# Altium schematic sheet Shifters.SchDoc
size A4
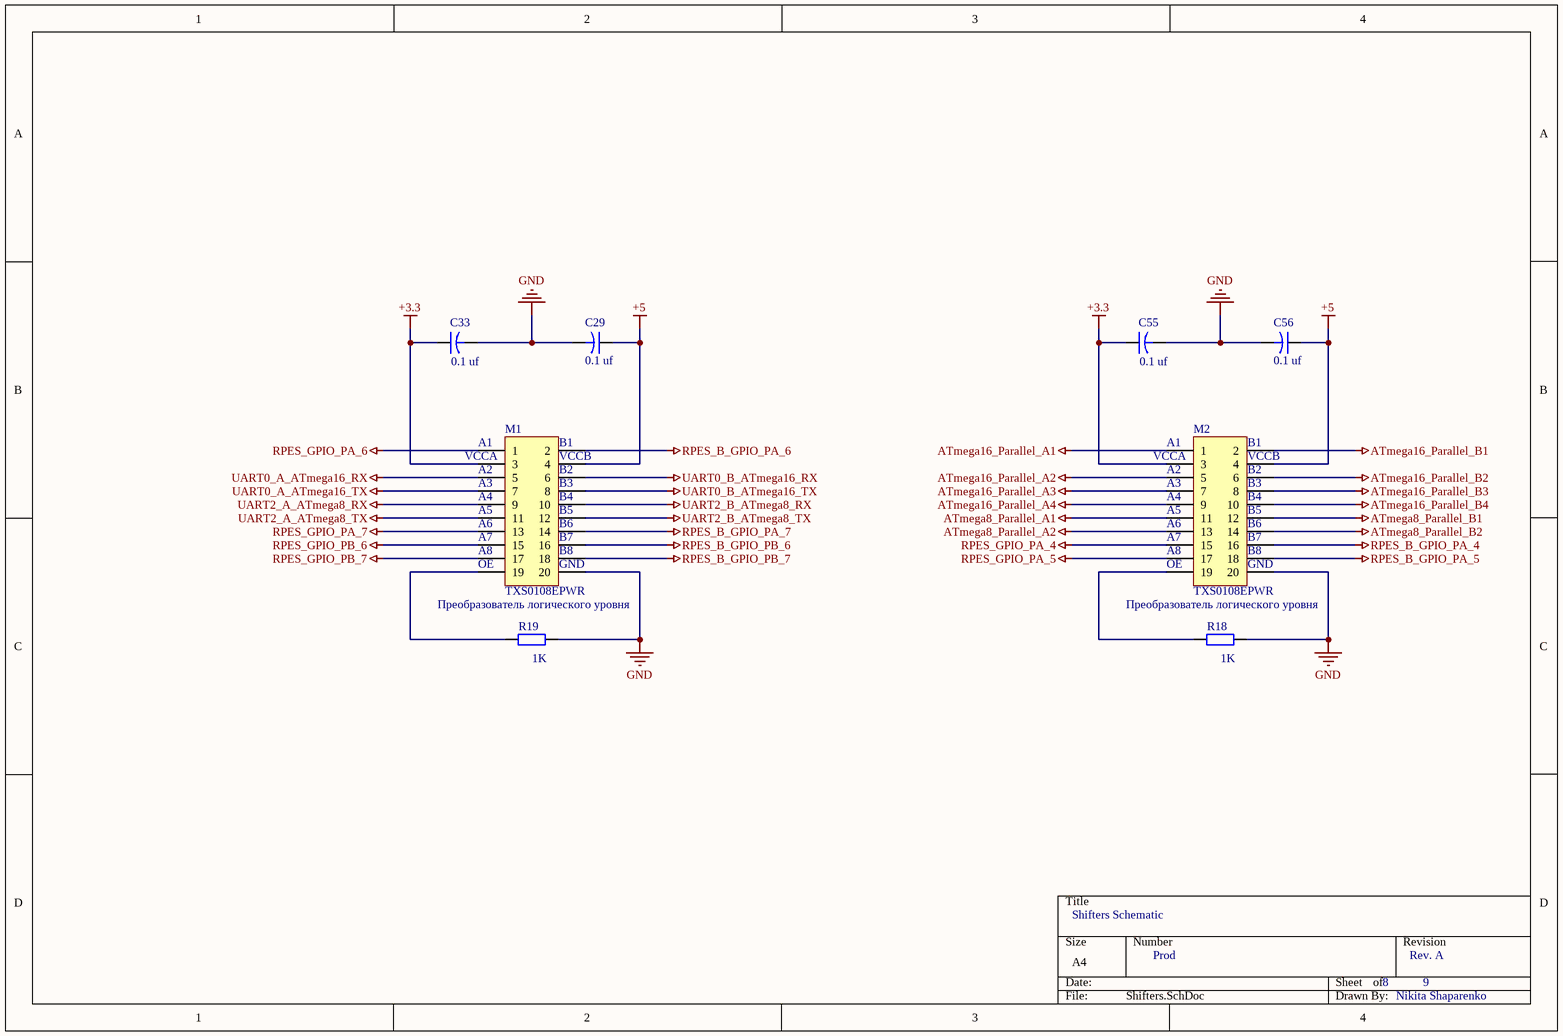
[diagram p0: Shifters.SchDoc]

## Parts
C29  value 0.1 uf  [CAPR5-4X5]  (hidden comment: Cap2)
C33  value 0.1 uf  [CAPR5-4X5]  (hidden comment: Cap2)
C55  value 0.1 uf  [CAPR5-4X5]  (hidden comment: Cap2)
C56  value 0.1 uf  [CAPR5-4X5]  (hidden comment: Cap2)
M1  TXS0108EPWR  [TSSOP20]
M2  TXS0108EPWR  [TSSOP20]
R18  value 1K  [AXIAL-0.4]  (hidden comment: Res2)
R19  value 1K  [AXIAL-0.4]  (hidden comment: Res2)

## Nets
+3.3: C33.1 C55.1 M1.3 M2.3
+5: C29.1 C56.1 M1.4 M2.4
ATmega8_Parallel_A1: M2.11
ATmega8_Parallel_A2: M2.13
ATmega8_Parallel_B1: M2.12
ATmega8_Parallel_B2: M2.14
ATmega16_Parallel_A1: M2.1
ATmega16_Parallel_A2: M2.5
ATmega16_Parallel_A3: M2.7
ATmega16_Parallel_A4: M2.9
ATmega16_Parallel_B1: M2.2
ATmega16_Parallel_B2: M2.6
ATmega16_Parallel_B3: M2.8
ATmega16_Parallel_B4: M2.10
GND: C29.2 C33.2 C55.2 C56.2 M1.20 M2.20 R18.2 R19.2
RPES_B_GPIO_PA_4: M2.16
RPES_B_GPIO_PA_5: M2.18
RPES_B_GPIO_PA_6: M1.2
RPES_B_GPIO_PA_7: M1.14
RPES_B_GPIO_PB_6: M1.16
RPES_B_GPIO_PB_7: M1.18
RPES_GPIO_PA_4: M2.15
RPES_GPIO_PA_5: M2.17
RPES_GPIO_PA_6: M1.1
RPES_GPIO_PA_7: M1.13
RPES_GPIO_PB_6: M1.15
RPES_GPIO_PB_7: M1.17
UART0_A_ATmega16_RX: M1.5
UART0_A_ATmega16_TX: M1.7
UART0_B_ATmega16_RX: M1.6
UART0_B_ATmega16_TX: M1.8
UART2_A_ATmega8_RX: M1.9
UART2_A_ATmega8_TX: M1.11
UART2_B_ATmega8_RX: M1.10
UART2_B_ATmega8_TX: M1.12
NetM1_19: M1.19 R19.1
NetM2_19: M2.19 R18.1

## Notes on the sheet
- (near M1) A1
- (near M1) B1
- (near M2) A1
- (near M2) B1
- (near M1) VCCA
- (near M1) A2
- (near M1) A3
- (near M1) A4
- (near M1) A5
- (near M1) VCCB
- (near M1) B2
- (near M1) B3
- (near M1) B4
- (near M1) B5
- (near M2) VCCA
- (near M2) A2
- (near M2) A3
- (near M2) A4
- (near M2) A5
- (near M2) VCCB
- (near M2) B2
- (near M2) B3
- (near M2) B4
- (near M2) B5
- (near M1) A6
- (near M1) A7
- (near M1) A8
- (near M1) OE
- (near M1) B6
- (near M1) B7
- (near M1) B8
- (near M1) GND
- (near M2) A6
- (near M2) A7
- (near M2) A8
- (near M2) OE
- (near M2) B6
- (near M2) B7
- (near M2) B8
- (near M2) GND
- Преобразователь логического уровня
- Shifters Schematic
- Prod
- 8
- Rev. A
- 9
- Nikita Shaparenko

## Library data of the parts
C29 C33 C55 C56 = Cap2: Capacitor; Published: 23-Sep-2002; PackageReference: CAPR5-4X5; Publisher: Altium Limited; PackageDescription: Capacitor; 2 Leads
M1 M2 = Header 10X2: Header, 10-Pin, Dual row; LatestRevisionDate: 17-Jul-2002; LatestRevisionNote: Re-released for DXP Platform.; Publisher: Altium Limited
R18 R19 = Res2: Resistor; Published: 8-Jun-2000; LatestRevisionDate: 17-Jul-2002; LatestRevisionNote: Re-released for DXP Platform.; PackageReference: AXIAL-0.4; Publisher: Altium Limited; PackageDescription: Axial Device, Thru-Hole; 2 Leads; 0.4 in Pin Spacing